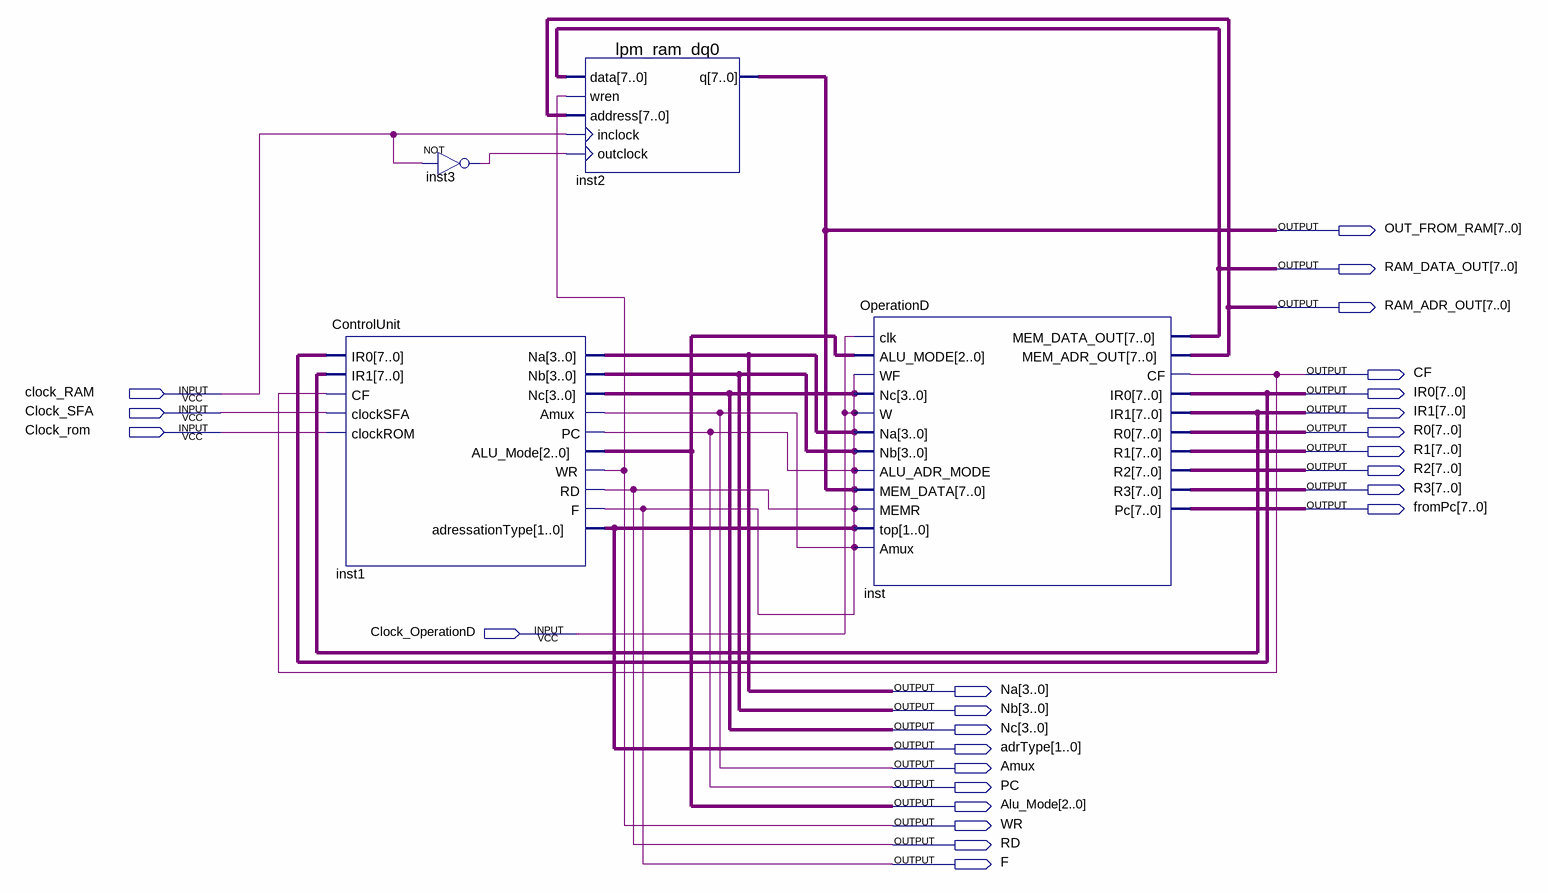
[diagram p0: schematic sheet]
// Quartus schematic CPU.bdf as structural Verilog: 4 symbols, 25 pins
module CPU (
  input  clock_RAM,
  input  Clock_SFA,
  input  Clock_rom,
  input  Clock_OperationD,
  output [7:0] OUT_FROM_RAM,
  output [7:0] RAM_DATA_OUT,
  output [7:0] RAM_ADR_OUT,
  output CF,
  output [7:0] IR0,
  output [7:0] IR1,
  output [7:0] R0,
  output [7:0] R1,
  output [7:0] R2,
  output [7:0] R3,
  output [7:0] fromPc,
  output [3:0] Na,
  output [3:0] Nb,
  output [3:0] Nc,
  output [1:0] adrType,
  output Amux,
  output PC,
  output [2:0] Alu_Mode,
  output WR,
  output RD,
  output F
);

  wire inst3_out;

  ControlUnit inst1 (
    .IR0(IR0), .IR1(IR1), .CF(CF), .clockSFA(Clock_SFA), .clockROM(Clock_rom), .Na(Na), .Nb(Nb), .Nc(Nc),
    .Amux(Amux), .PC(PC), .ALU_Mode(Alu_Mode), .WR(WR), .RD(RD), .F(Amux), .adressationType(adrType));
  not inst3 (inst3_out, clock_RAM);
  lpm_ram_dq0 inst2 (
    .data(RAM_DATA_OUT), .wren(WR), .address(RAM_ADR_OUT), .inclock(clock_RAM), .outclock(inst3_out),
    .q(OUT_FROM_RAM));
  OperationD inst (
    .clk(Clock_OperationD), .ALU_MODE(Alu_Mode), .WF(Clock_OperationD), .Nc(Nc), .W(Clock_OperationD),
    .Na(Na), .Nb(Nb), .ALU_ADR_MODE(PC), .MEM_DATA(OUT_FROM_RAM), .MEMR(RD), .top(adrType), .Amux(Amux),
    .MEM_DATA_OUT(RAM_DATA_OUT), .MEM_ADR_OUT(RAM_ADR_OUT), .CF(CF), .IR0(IR0), .IR1(IR1), .R0(R0), .R1(R1),
    .R2(R2), .R3(R3), .Pc(fromPc));

  assign F = Amux;
endmodule
